# EAGLE design ATTiny10ProgrammingAdapter (EAGLE 6.4)
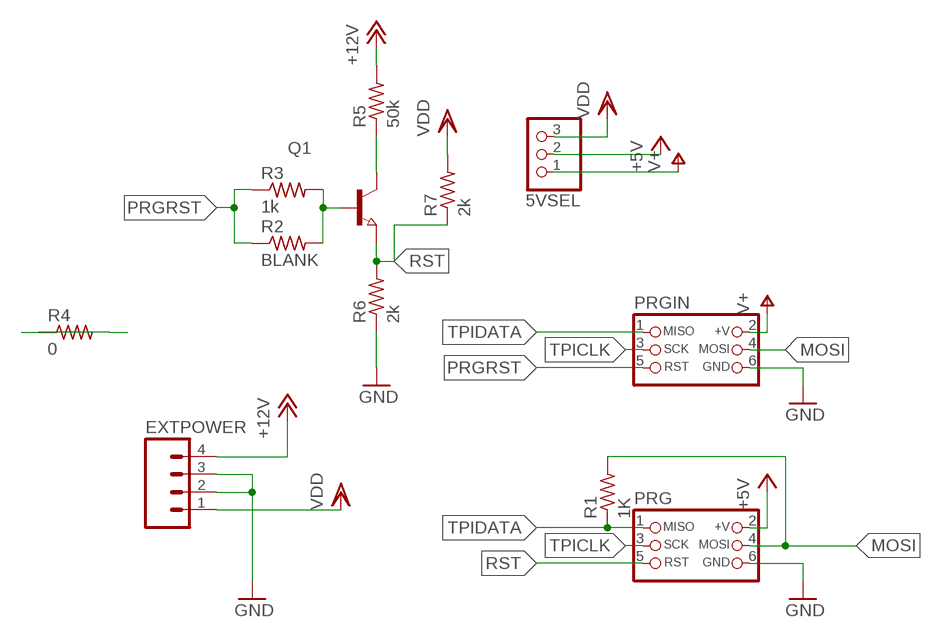
[diagram p0: schematic, sheet 1]

## Parts
5VSEL  PINHD-1X3CB  [1X03-CLEANBIG]
EXTPOWER  HEADER1X4SMD_LONGPADS  [1X04-SMD-LONG]
PRG  CON_HEADER_PRG_AVR_ICSP_ETCH  [HEADER_PRG_2X03_ETCH]
PRGIN  CON_HEADER_PRG_AVR_ICSP_ETCH  [HEADER_PRG_2X03_ETCH]
Q1  NPN-TRANSISTOR_SOT23  [SOT23]
R1  1K  R-US_R0805  [R0805]
R2  BLANK  R-US_R0805  [R0805]
R3  1k  R-US_R0805  [R0805]
R4  0  R-US_R1206  [R1206]
R5  50k  R-US_R0805  [R0805]
R6  2k  R-US_R0805  [R0805]
R7  2k  R-US_R0805  [R0805]

## Nets
+5V: 5VSEL.2 PRG.2(+V)
+12V: EXTPOWER.4 R4.1 R4.2 R5.2
GND: EXTPOWER.2 EXTPOWER.3 PRG.6(GND) PRGIN.6(GND) R6.1
MOSI: PRG.4(MOSI) PRGIN.4(MOSI) R1.2
N$1: Q1.1(B) R2.2 R3.2
N$4: Q1.3(C) R5.1
PRGRST: PRGIN.5(RST) R2.1 R3.1
RST: PRG.5(RST) Q1.2(E) R6.2 R7.1
TPICLK: PRG.3(SCK) PRGIN.3(SCK)
TPIDATA: PRG.1(MISO) PRGIN.1(MISO) R1.1
V+: 5VSEL.1 PRGIN.2(+V)
VDD: 5VSEL.3 EXTPOWER.1 R7.2

## Library data of the parts
5VSEL = adafruit:PINHD-1X3: PIN HEADER
EXTPOWER = LL:HEADER1X4: Header 4 Standard 4-pin 0.1" header. Modified from sparkfun for etch footprints
PRG PRGIN = LL:CON_HEADER_PRG_AVR_ICSP_ETCH: 2x3 AVR ICSP programming header for etching
Q1 = semicon-smd-ipc:NPN-TRANSISTOR_: NPN TRANSISTOR
R1 R4 = LL:R-US_: RESISTOR, American symbol
R2 R3 R5-R7 = adafruit:R-US_: RESISTOR, American symbol

## Board
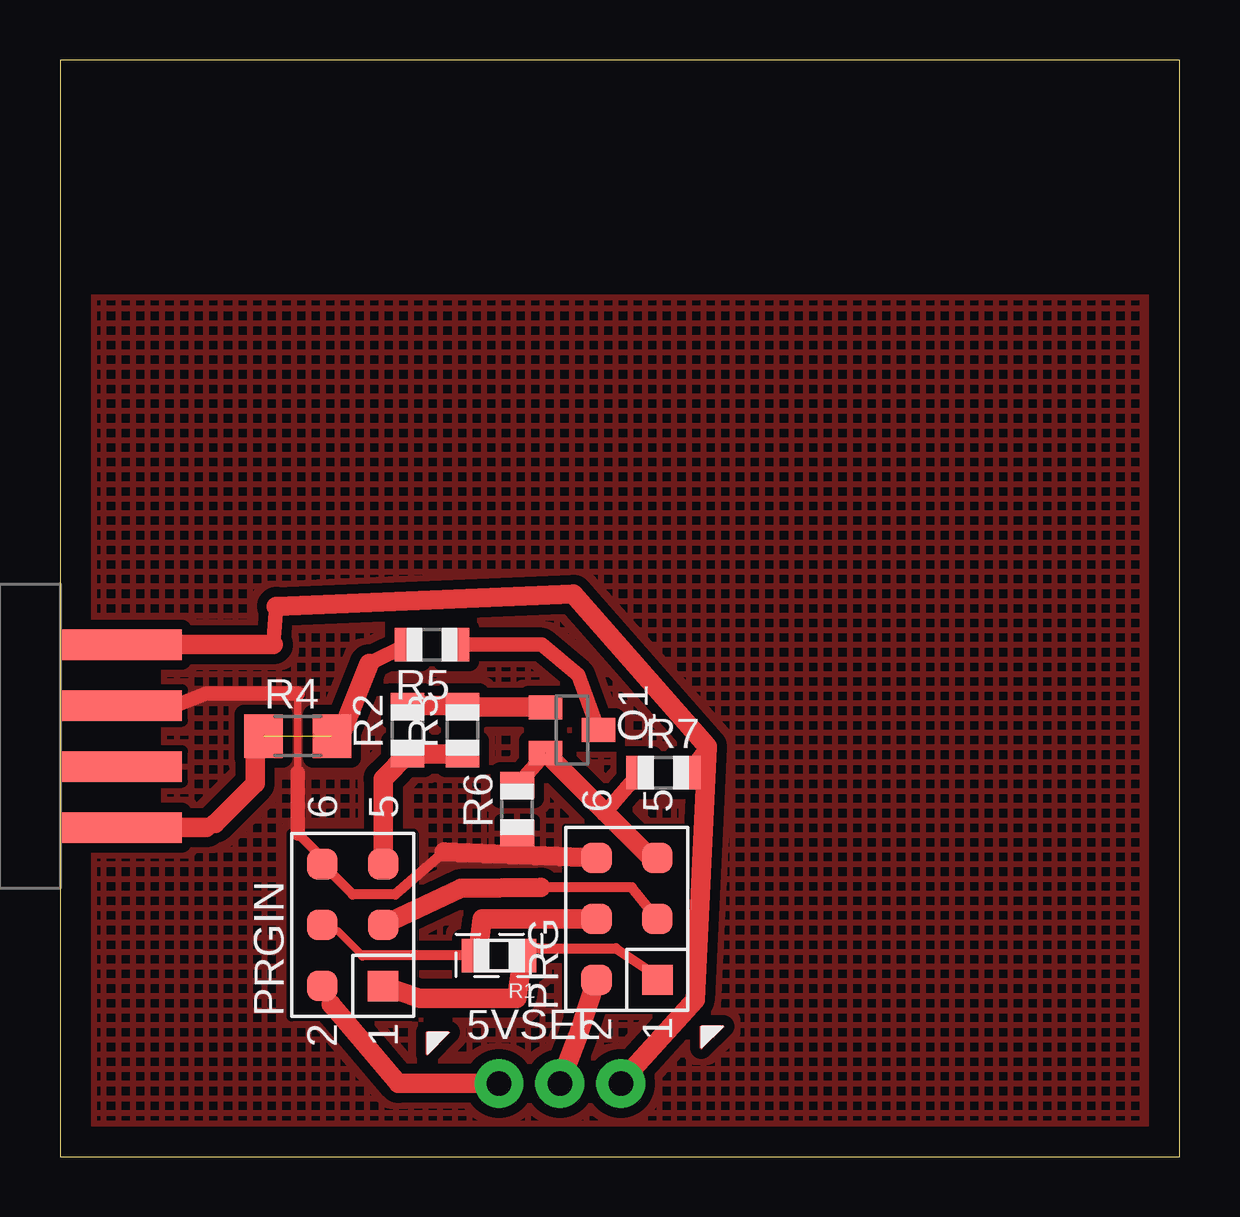
[diagram p1: board, top side]
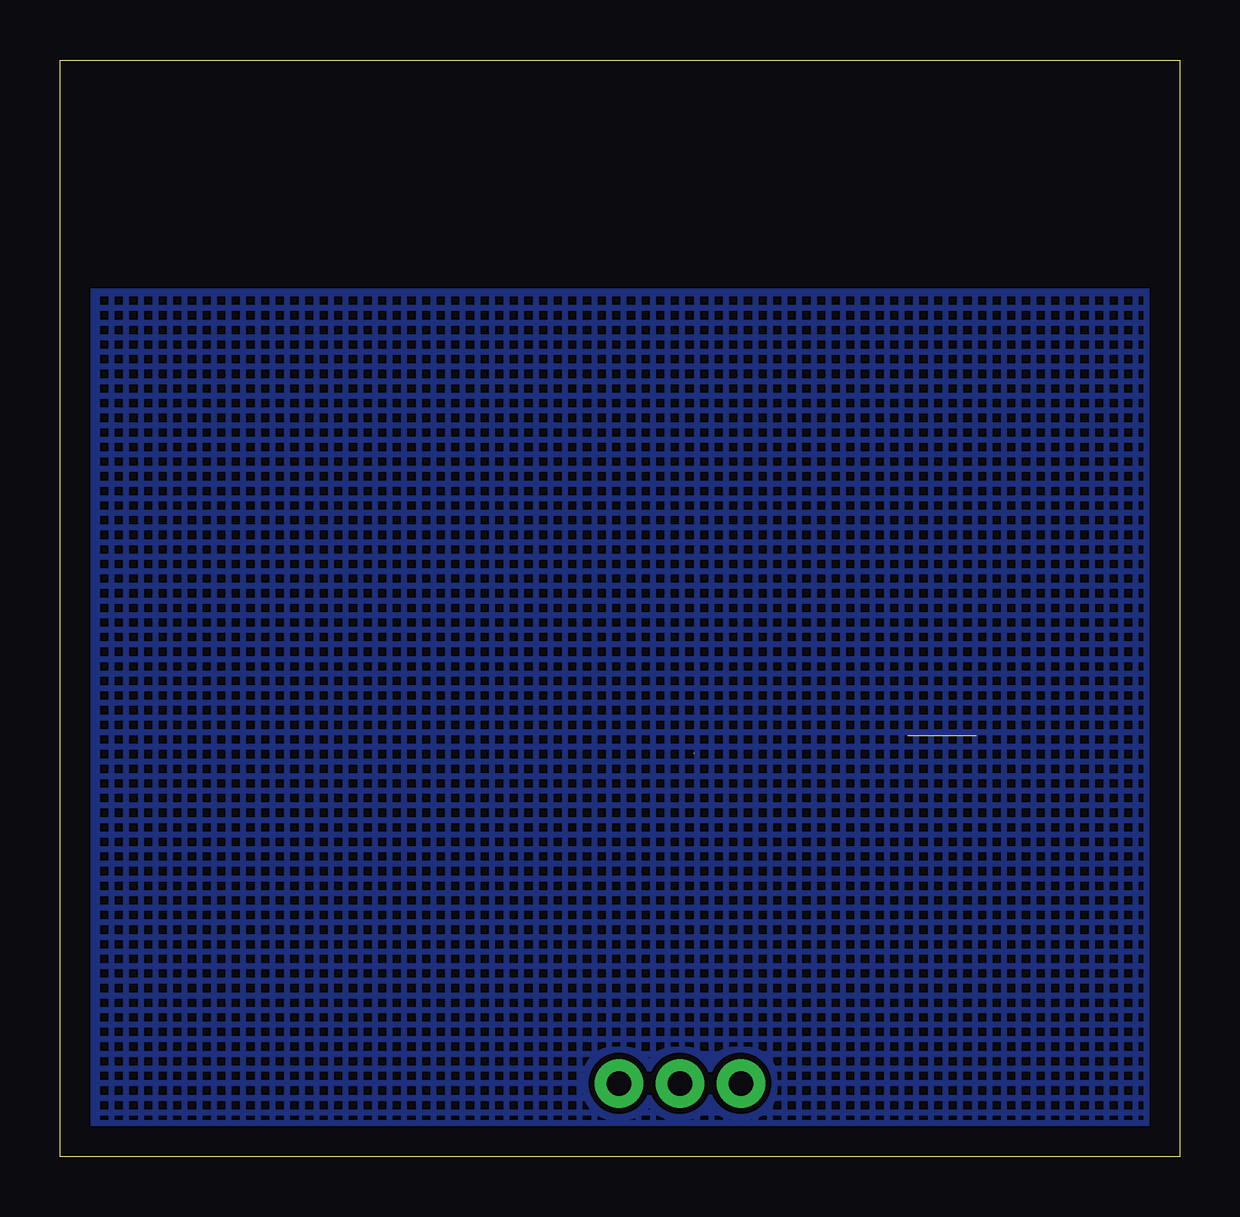
[diagram p2: board, bottom side, seen from below]

Size 46.66 x 45.71 mm. Coordinates in mm from the lower left corner, seen from the top.
Outline: 0,0 46.66,0 46.66,45.71 0,45.71 0,0
Copper layers (1*16): Top 0.0356mm / dielectric 1.5011mm / Bottom 0.0356mm
Design rules "ll-etch-lax": minimum track width 8mil, minimum drill 21mil, track to track 8mil, track to pad 7mil, pad to pad 12mil, via to via 20mil, smd to smd 4mil, copper to edge 50mil, drill to drill 30mil, minimum pad ring 20mil, minimum via ring 18mil, stop-mask expansion 0mil, vias tented up to drill 20mil, thermal gap 10mil

### Footprints (pad centres in the part's own frame; a part is rotated, then mirrored left to right if it is on the bottom)
1X03-CLEANBIG = drill 1.016 pad 1.676: 1 -2.54,0; 2 0,0; 3 2.54,0
1X04-SMD-LONG = smd 1.27 x 5.08: 1 -3.81,0; 2 -1.27,0; 3 1.27,0; 4 3.81,0
HEADER_PRG_2X03_ETCH = smd 1.27 x 1.27: 1 -2.54,-1.27; 2 -2.54,1.27; 3 0,-1.27; 4 0,1.27; 5 2.54,-1.27; 6 2.54,1.27
SOT23 = smd 1 x 1.4: 1 -0.95,-1.1; 2 0.95,-1.1; 3 0,1.1
R0805 = smd 1.1 x 1.4: 1 -1,0; 2 1,0
R1206 = smd 1.6 x 1.803: 1 -1.422,0; 2 1.422,0

### Placement (x,y rotation side)
5VSEL  20.83,3.05 0 top
EXTPOWER  2.54,17.53 270 top
PRG  23.62,9.91 90 top
PRGIN  12.19,9.65 90 top
Q1  21.34,17.78 270 top
R1  18.29,8.38 180 top
R2  14.48,17.78 90 top
R3  16.76,17.78 90 top
R4  9.91,17.53 0 top
R5  15.49,21.34 180 top
R6  19.05,14.48 90 top
R7  25.15,16 0 top

### Tracks (layer width: path | path; a pad name or v marks a point on that pad's centre or on a via)
+5V
  Top 0.813: PRG.2 21.59,5.08 5VSEL.2
+12V  (1 unrouted)
  Top 0.254: 8.13,17.27 8.38,17.53 | 6.48,13.89 6.1,13.72
  Top 0.406: 8.38,17.53 R4.1 | 11.68,17.53 R4.2
  Top 0.61: R5.2 12.88,20.55
  Top 0.813: EXTPOWER.4 6.1,13.72 | 6.48,13.89 8.13,15.54 8.13,17.27 | 11.68,17.53 12.88,20.55
GND
  Top 0.305: PRGIN.6 10.92,12.45 | 9.91,16 9.91,19.3
  Top 0.406: 16,12.7 13.97,10.92 12.19,10.92 PRGIN.6 | 10.92,12.45 9.91,13.46 | 4.83,18.8 EXTPOWER.2
  Top 0.61: 9.91,13.46 9.91,16 | 9.91,19.3 6.1,19.3 4.83,18.8
  Top 0.813: PRG.6 16,12.7
  pour Top (isolate 0.406, rank 3, hatched): 1.27,1.02 45.72,1.02 45.72,35.81 1.27,35.81
  pour Bottom (isolate 0.254, rank 2, hatched): 1.27,1.02 45.72,1.02 45.72,36.07 1.27,36.07
MOSI
  Top 0.254: 11.58,9.4 PRGIN.4 | 17.4,8.43 R1.2
  Top 0.305: 12.6,8.38 11.58,9.4
  Top 0.406: R1.2 12.6,8.38
  Top 0.813: PRG.4 17.6,9.91 17.4,8.43
N$1
  Top 0.254: 14.48,18.8 R2.2 | 16.76,18.8 R3.2 16.87,18.75 | 20.22,18.75 Q1.1
  Top 0.813: 16.76,18.8 14.48,18.8 | 16.87,18.75 20.22,18.75
N$2
  cutout Top: 9.65,13.46 14.73,13.46 14.73,5.84 9.65,5.84 9.65,6.1
N$3
  cutout Top: 21.08,13.46 21.08,6.1 26.16,6.1 26.16,13.72 21.08,13.72
N$4
  Top 0.61: Q1.3 21.59,20.07 20.07,21.34 R5.1
PRGRST
  Top 0.254: 14.48,16.76 R2.1 14.58,16.79 | R3.1
  Top 0.813: PRGIN.5 13.46,15.75 14.48,16.76 | 14.58,16.79 R3.1
RST  (1 unrouted)
  Top 0.254: 24.61,12.45 PRG.5
  Top 0.61: 20.24,16.82 R6.2 | R7.1 22.72,14.34
  Top 0.813: 20.24,16.82 22.72,14.34 24.61,12.45
TPICLK
  Top 0.406: 20.04,11.23 23.82,11.23 PRG.3
  Top 0.813: PRGIN.3 16.69,11.18 20.04,11.23
TPIDATA
  Top 0.254: R1.1 19.91,8.69 | 24.74,7.62 PRG.1
  Top 0.406: 24.74,7.62 23.16,8.69 19.91,8.69
  Top 0.813: PRGIN.1 14.99,6.6 19.02,6.6 R1.1
V+
  Top 0.254: 11.3,6.35 PRGIN.2
  Top 0.813: 11.3,6.35 14.1,3.05 5VSEL.1
VDD
  Top 0.254: 23.88,3.68 5VSEL.3
  Top 0.61: 9.02,22.94 8.89,21.34 | 26.98,17.09 R7.2
  Top 0.813: EXTPOWER.1 8.89,21.34 | 23.88,3.68 26.47,6.53 26.98,17.09 21.39,23.44 9.02,22.94